# EAGLE schematic Shematich_v1 (EAGLE 9.6.2)
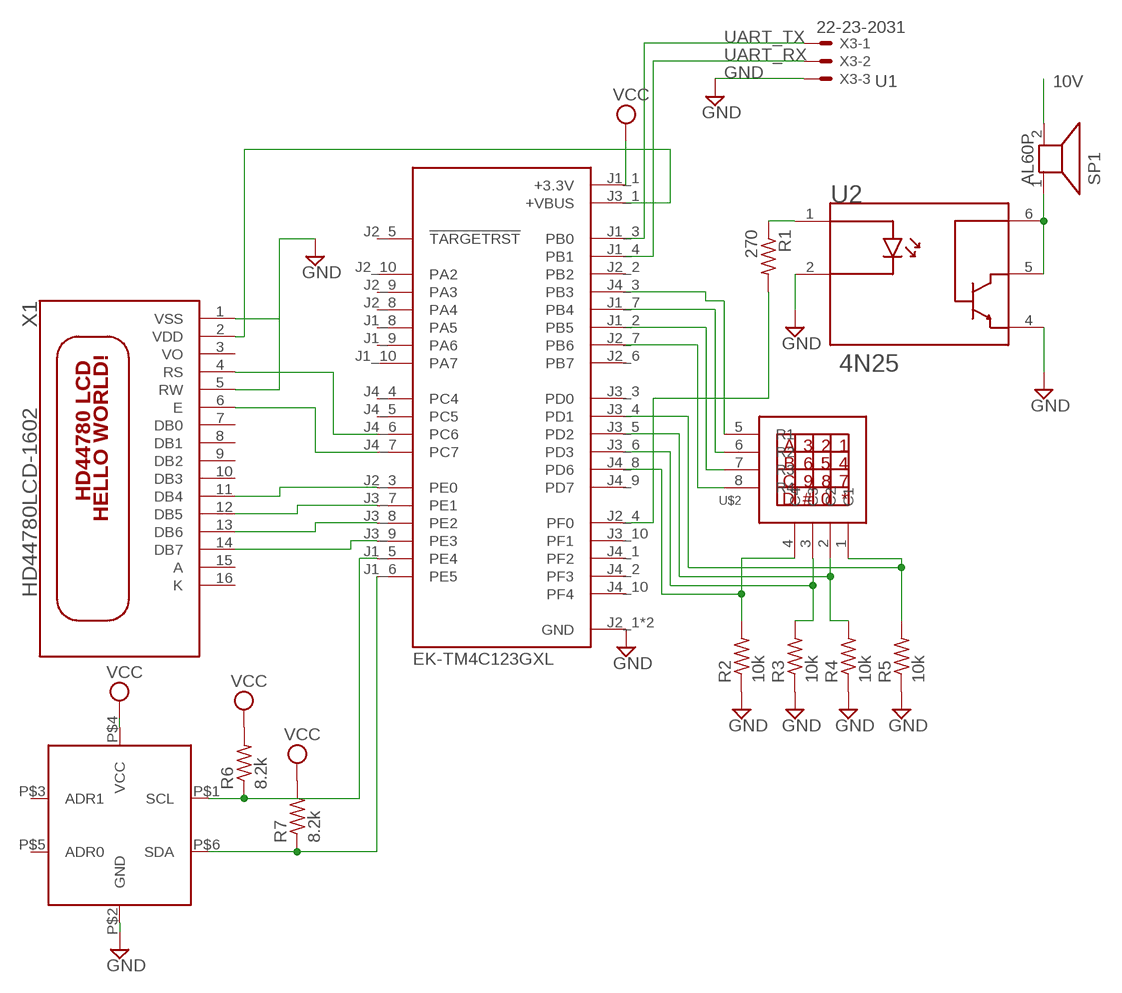
[diagram p0: schematic, sheet 1]

## Parts
R1  270  R-US_0204/7  [0204/7]
R2  10k  R-US_0204/7  [0204/7]
R3  10k  R-US_0204/7  [0204/7]
R4  10k  R-US_0204/7  [0204/7]
R5  10k  R-US_0204/7  [0204/7]
R6  8.2k  R-US_0204/7  [0204/7]
R7  8.2k  R-US_0204/7  [0204/7]
SP1  AL60P  [AL60P]
U1  EK-TM4C123GXL  [MODULE_EK-TM4C123GXL]
U2  4N25  [DIP762W50P254L712H400Q6N]
U$1  TMP100  [SOT23-6]
U$2  KEYPAD4X4  [KEYPAD4X4]
X1  HD44780LCD-1602  [LCD1602]
X3  22-23-2031  [22-23-2031]

## Nets
10V: SP1.2
GND: R2.1 R3.1 R4.1 R5.1 U1.J2_1(GND) U1.J3_2(GND) U2.2(K) U2.4(E) U$1.P$2(GND) X1.1(VSS) X1.5(RW) X3.3
N$1: R1.2 U1.J2_4(PF0)
N$2: U1.J2_3(PE0) X1.11(DB4)
N$3: R3.2 U1.J3_6(PD3) U$2.3(C3)
N$4: R7.1 U1.J1_6(PE5) U$1.P$6(SDA)
N$6: U1.J3_7(PE1) X1.12(DB5)
N$7: U1.J3_8(PE2) X1.13(DB6)
N$8: U1.J3_9(PE3) X1.14(DB7)
N$9: U1.J4_7(PC7) X1.6(E)
N$10: U1.J4_6(PC6) X1.4(RS)
N$11: R1.1 U2.1(A)
N$12: SP1.1 U2.5(C) U2.6(B)
N$13: R2.2 U1.J4_8(PD6) U$2.4(C4)
N$14: R4.2 U1.J3_5(PD2) U$2.2(C2)
N$16: U1.J4_3(PB3) U$2.5(R1)
N$17: U1.J1_7(PB4) U$2.6(R2)
N$18: U1.J1_2(PB5) U$2.7(R3)
N$19: U1.J2_7(PB6) U$2.8(R4)
N$20: R5.2 U1.J3_4(PD1) U$2.1(C1)
N$21: R6.1 U1.J1_5(PE4) U$1.P$1(SCL)
UART_RX: U1.J1_4(PB1) X3.2
UART_TX: U1.J1_3(PB0) X3.1
VCC: R6.2 R7.2 U1.J1_1(+3.3V) U$1.P$4(VCC)
VDD: U1.J3_1(+VBUS) X1.2(VDD)
Unconnected: U1.J1_8(PA5) U1.J1_9(PA6) U1.J1_10(PA7) U1.J2_2(PB2) U1.J2_5(!TARGETRST) U1.J2_6(PB7) U1.J2_8(PA4) U1.J2_9(PA3) U1.J2_10(PA2) U1.J3_3(PD0) U1.J3_10(PF1) U1.J4_1(PF2) U1.J4_2(PF3) U1.J4_4(PC4) U1.J4_5(PC5) U1.J4_9(PD7) U1.J4_10(PF4) U$1.P$3(ADR1) U$1.P$5(ADR0) X1.3(VO) X1.7(DB0) X1.8(DB1) X1.9(DB2) X1.10(DB3) X1.15(A) X1.16(K)

## Library data of the parts
R1-R7 = rcl:R-US_: RESISTOR, American symbol; SPICEPREFIX: R
SP1 = buzzer:AL60P: SPEAKER Source: Buerklin; OC_FARNELL: unknown; OC_NEWARK: unknown
U1 = EK-TM4C123GXL:EK-TM4C123GXL: ARM® Cortex®-M4F Based MCU TM4C123G LaunchPad™ Evaluation Kit Check availability <https://pricing.snapeda.com/parts/EK-TM4C123GXL/Texas%20Instruments/view-part?ref=eda>; AVAILABILITY: In Stock; CHECK_PRICES: https://www.snapeda.com/parts/EK-TM4C123GXL/Texas+Instruments/view-part/?ref=eda; DESCRIPTION: ARM® Cortex®-M4F Based MCU TM4C123G LaunchPad™ Evaluation Kit; MF: Texas Instruments; MP: EK-TM4C123GXL; PACKAGE: None; PRICE: None; PURCHASE-URL: https://www.snapeda.com/api/url_track_click_mouser/?unipart_id=132968&manufacturer=Texas Instruments&part_name=EK-TM4C123GXL&search_term=None; SNAPEDA_LINK: https://www.snapeda.com/parts/EK-TM4C123GXL/Texas+Instruments/view-part/?ref=snap
U2 = 4N25:4N25: Optoisolator, Transistor Output Check availability <https://pricing.snapeda.com/parts/4N25/Vishay%20Semiconductor/view-part?ref=eda>; AVAILABILITY: In Stock; CHECK_PRICES: https://www.snapeda.com/parts/4N25/Vishay+Semiconductor+Opto+Division/view-part/?ref=eda; DESCRIPTION: Optoisolator, Analog, 6-Pin DIP, Transistor, w/Base Connection | Vishay / Small Signal & Opto Products (SSP) 4N25; MF: Vishay Semiconductor; MP: 4N25; PACKAGE: DIP-6 Everlight; PRICE: None; PURCHASE-URL: https://www.snapeda.com/api/url_track_click_mouser/?unipart_id=422396&manufacturer=Vishay Semiconductor&part_name=4N25&search_term=None; SNAPEDA_LINK: https://www.snapeda.com/parts/4N25/Vishay+Semiconductor+Opto+Division/view-part/?ref=snap
U$1 = tmp10x:TMP100: Digital Temperature sensor from Texas Instruments Digital output : I2C Resolution : 9 to 12bit Accuracy : 2'C from -25'C to 85'C ; 3'C from -55'C to 125'C Supply : 2,7 to 5,5V / 45uA (standby 0,1uA)
U$2 = keypad_4x4_raw:KEYPAD4X4
X1 = adafruit:HD44780LCD: HD44780 LCD Standard character type LCDs, available in sizes from 8x1 to 40x4!
X3 = con-molex:22-23-2031: .100" (2.54mm) Center Header - 3 Pin; MF: MOLEX; MPN: 22-23-2031; OC_FARNELL: 1462950; OC_NEWARK: 30C0862